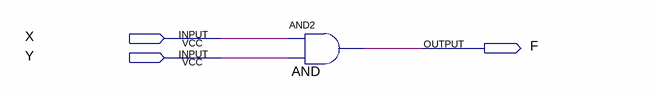
[diagram p0: schematic sheet]
// Quartus schematic lab1_TAB_460.bdf as structural Verilog: 1 symbols, 3 pins
module lab1_TAB_460 (
  input  X,
  input  Y,
  output F
);

  and AND (F, X, Y);
endmodule
